# Altium project TPcape_basic.PrjPCB
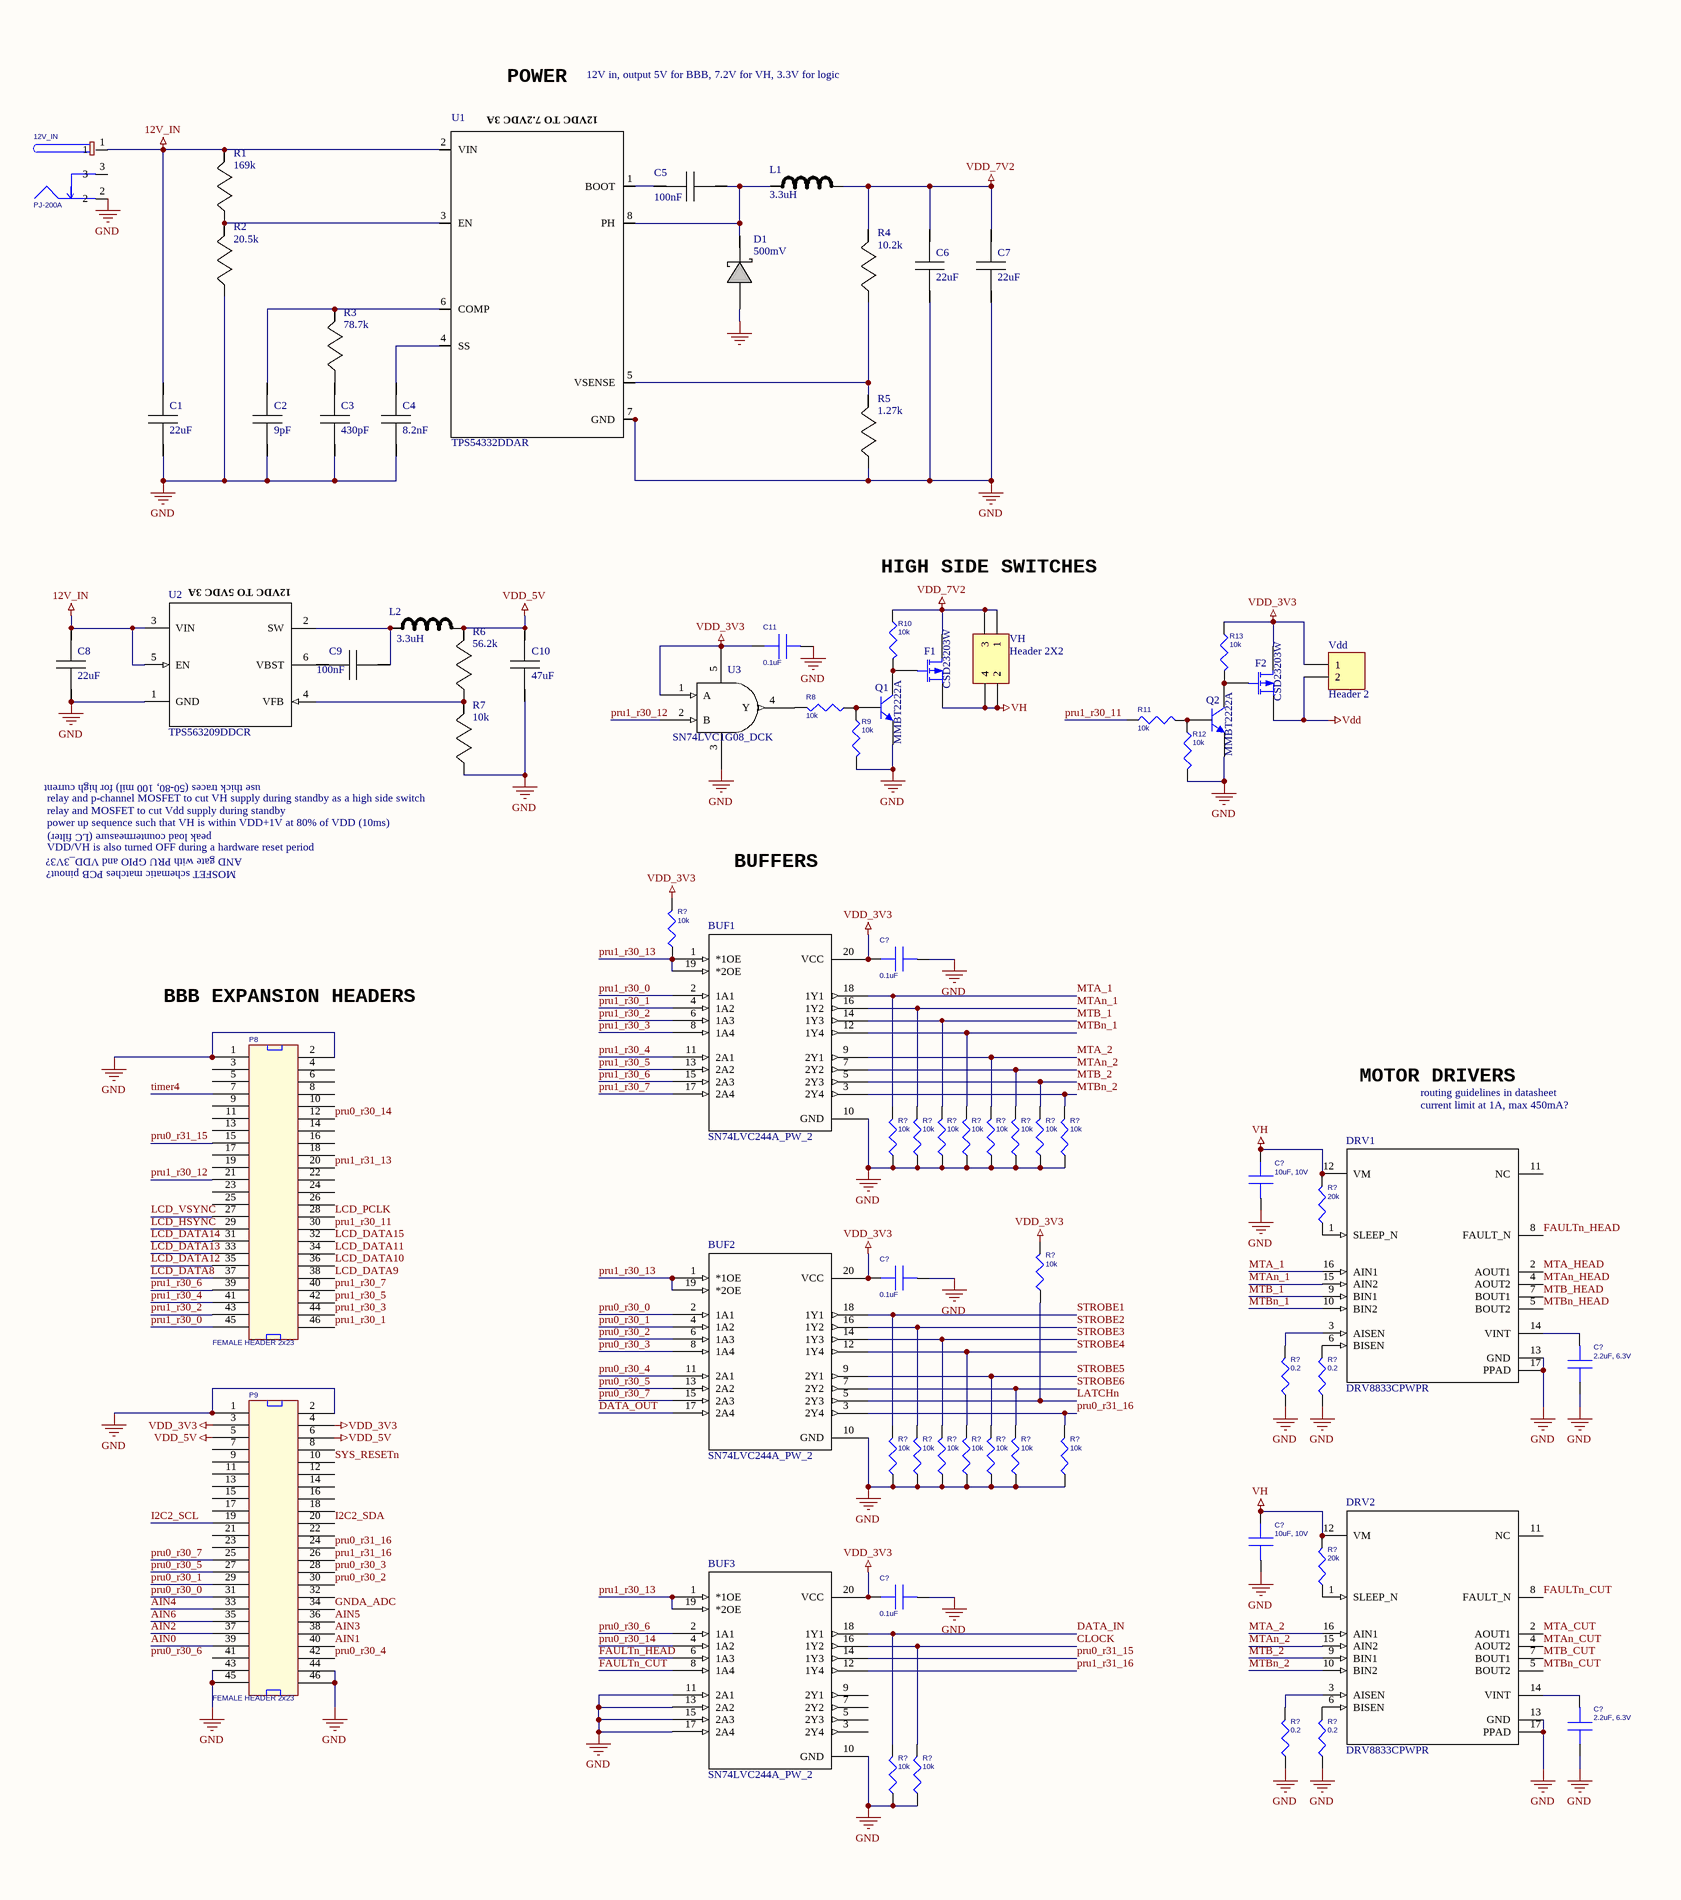
[diagram p0: TPcape_basic.SchDoc, left]
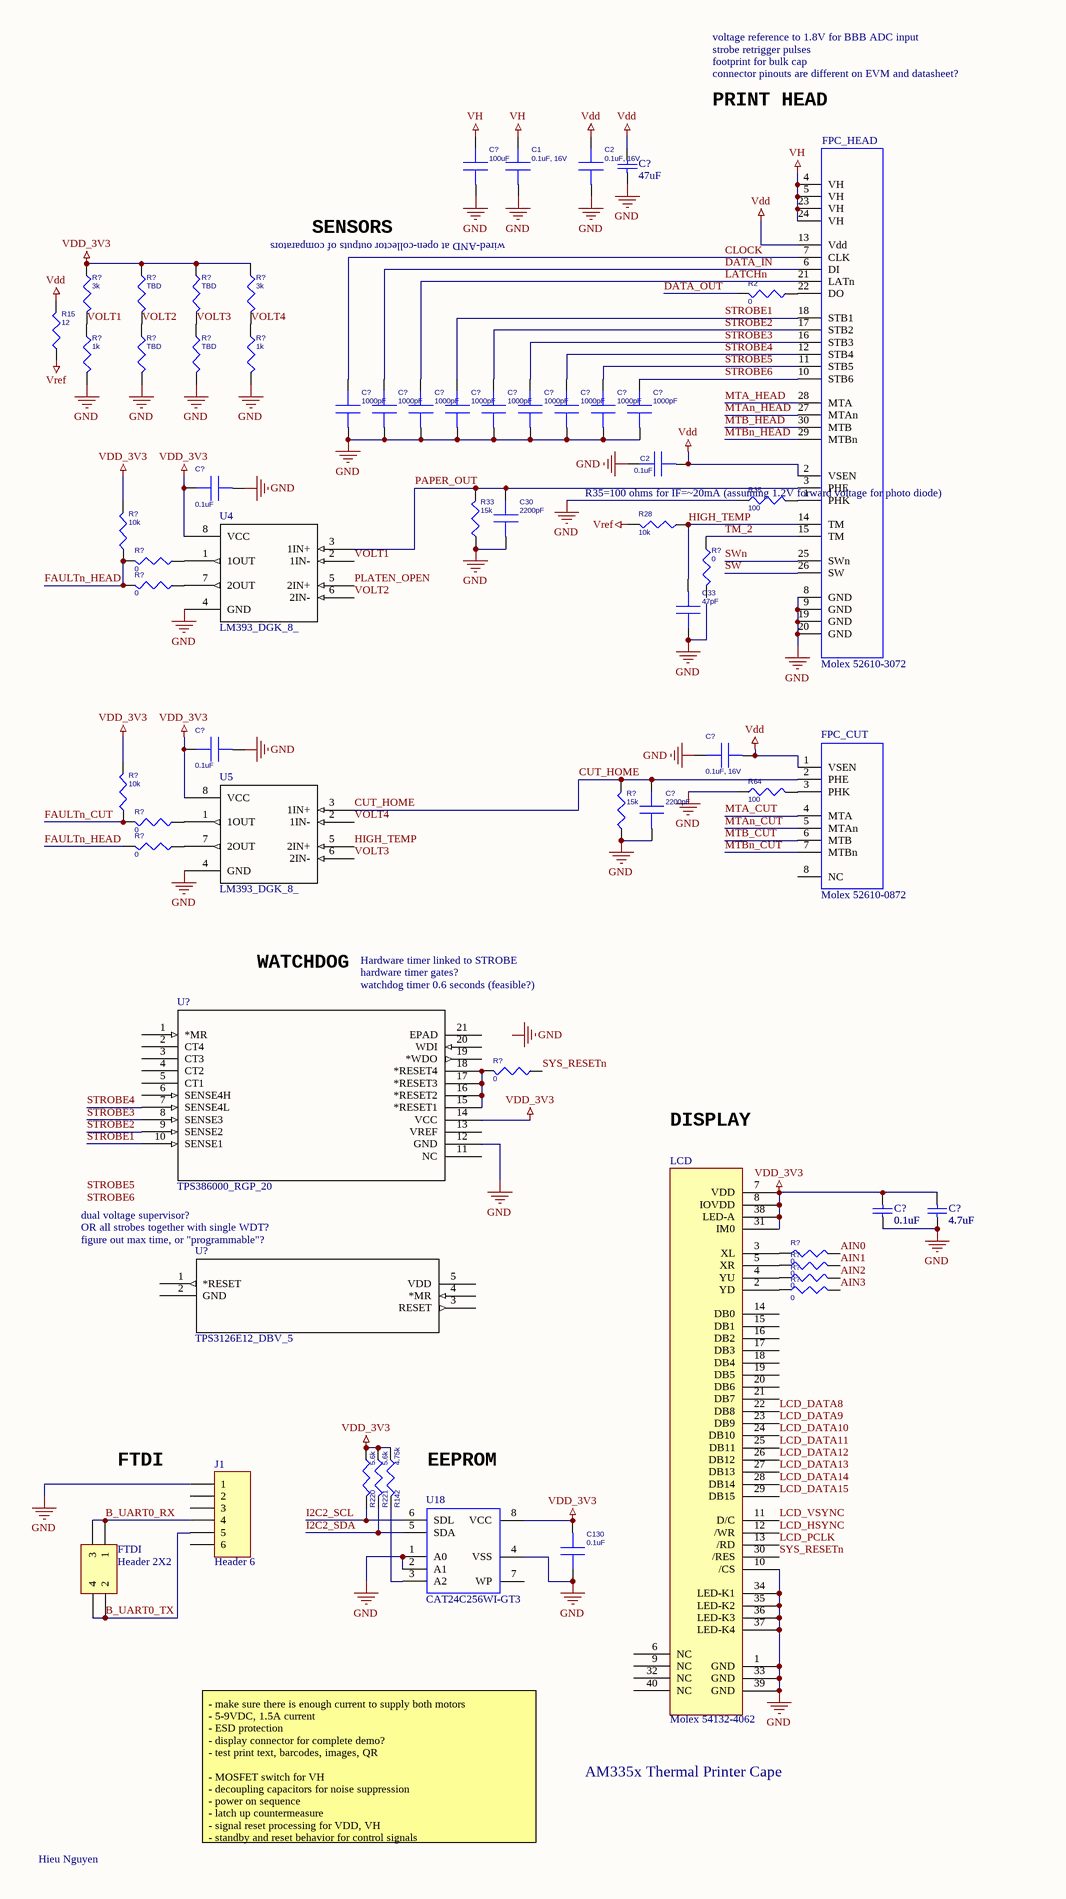
[diagram p1: TPcape_basic.SchDoc, right]
1 sheet, 139 parts. Net scope: global (net labels, ports and power ports of the same name join across sheets).
Board file: TPcape_basic.PcbDoc

## Sheet TPcape_basic.SchDoc
size A2; PageSetup: Record=PageOptions|CenterHorizontal=True|CenterVertical=True|PrintScale=0.77|XCorrection=1.00|YCorrection=1.00|PrintKind=1|BorderSize=5000000|LeftOffset=0|BottomOffset=0|Orientation=2|PaperLength=1000|PaperWidth=1000|Scale=100|PaperSource=7|PrintQuality=-4|MediaType=1|DitherType=10|PrintScaleMode=1|PaperKind=A5|PaperIndex=11

### Parts
(Parts that share a designator on the sheet are numbered #1, #2 ... from top to bottom, then left to right.)
12V_IN  PJ-200A  [CONN3-PWR-PJ102A]
BUF1  SN74LVC244A_PW_2  [PW20]
BUF2  SN74LVC244A_PW_2  [PW20]
BUF3  SN74LVC244A_PW_2  [PW20]
C1#1  0.1uF, 16V  [402]
C1#2  22uF  [1210]
C2#1  0.1uF, 16V  [402]
C2#2  9pF  [0805]
C2#3  0.1uF  [402]
C3  430pF  [0805]
C4  8.2nF  [0201]
C5  100nF  [1005]
C6  22uF  [1210]
C7  22uF  [1210]
C8  22uF  [1210]
C9  100nF  [0805]
C10  47uF  [1206]
C11  0.1uF  [402]
C30  2200pF  [402]
C33  47pF  [402]
C130  0.1uF  [402]
C?#1  47uF  [C1206]
C?#2  100uF  [RD205SMD_250D]
C?#3  1000pF  [402]
C?#4  1000pF  [402]
C?#5  1000pF  [402]
C?#6  1000pF  [402]
C?#7  1000pF  [402]
C?#8  1000pF  [402]
C?#9  1000pF  [402]
C?#10  1000pF  [402]
C?#11  1000pF  [402]
C?#12  0.1uF  [402]
C?#13  0.1uF  [402]
C?#14  0.1uF, 16V  [402]
C?#15  2200pF  [402]
C?#16  0.1uF  [402]
C?#17  10uF, 10V  [805]
C?#18  0.1uF  [0402]
C?#19  4.7uF  [C1206]
C?#20  0.1uF  [402]
C?#21  2.2uF, 6.3V  [402]
C?#22  10uF, 10V  [805]
C?#23  0.1uF  [402]
C?#24  2.2uF, 6.3V  [402]
D1  500mV  [SMB]
DRV1  DRV8833CPWPR  [DRV8833CPWPR]
DRV2  DRV8833CPWPR  [DRV8833CPWPR]
F1  CSD23203W  [CSD23203W]
F2  CSD23203W  [CSD23203W]
FPC_CUT  Molex 52610-0872  [Molex 52610-0872]
FPC_HEAD  Molex 52610-3072  [Molex 52610-3072]
FTDI  Header 2X2  [SSM-102-S-DV]
J1  Header 6  [HDR1X6]
L1  3.3uH  [XAL4030]
L2  3.3uH  [VLP8040]
LCD  Molex 54132-4062  [Molex 54132-4062]
P8  FEMALE HEADER 2x23  [HDR2x23]
P9  FEMALE HEADER 2x23  [HDR2X23]
Q1  MMBT2222A  [MMBT2222A]
Q2  MMBT2222A  [MMBT2222A]
R1  169k  [0402]
R2#1  20.5k  [0402]
R2#2  0  [402]
R3  78.7k  [0402]
R4  10.2k  [0402]
R5  1.27k  [0402]
R6  56.2k  [0402]
R7  10k  [0402]
R8  10k  [402]
R9  10k  [402]
R10  10k  [402]
R11  10k  [402]
R12  10k  [402]
R13  10k  [402]
R15  12  [402]
R28  10k  [402]
R33  15k  [402]
R35  100  [805]
R64  100  [805]
R142  4.75k  [402]
R220  5.6k  [402]
R221  5.6k  [402]
R?#1  3k  [402]
R?#2  TBD  [402]
R?#3  TBD  [402]
R?#4  3k  [402]
R?#5  1k  [402]
R?#6  TBD  [402]
R?#7  TBD  [402]
R?#8  1k  [402]
R?#9  10k  [402]
R?#10  0  [402]
R?#11  0  [402]
R?#12  0  [402]
R?#13  10k  [402]
R?#14  0  [402]
R?#15  15k  [402]
R?#16  0  [402]
R?#17  10k  [402]
R?#18  0  [402]
R?#19  10k  [402]
R?#20  10k  [402]
R?#21  10k  [402]
R?#22  10k  [402]
R?#23  10k  [402]
R?#24  10k  [402]
R?#25  10k  [402]
R?#26  10k  [402]
R?#27  20k  [402]
R?#28  0  [402]
R?#29  10k  [402]
R?#30  0  [402]
R?#31  0  [402]
R?#32  0  [402]
R?#33  0.2  [402]
R?#34  0.2  [402]
R?#35  10k  [402]
R?#36  10k  [402]
R?#37  10k  [402]
R?#38  10k  [402]
R?#39  10k  [402]
R?#40  10k  [402]
R?#41  10k  [402]
R?#42  20k  [402]
R?#43  0.2  [402]
R?#44  0.2  [402]
R?#45  10k  [402]
R?#46  10k  [402]
U1  TPS54332DDAR  [DDA0008H]
U2  TPS563209DDCR  [DDC0006A]
U3  SN74LVC1G08_DCK  [DCK5]
U4  LM393_DGK_8_  [DGK8]
U5  LM393_DGK_8_  [DGK8]
U18  CAT24C256WI-GT3  [CAT24C256WI-GT3]
U?#1  TPS386000_RGP_20  [RGP20_2P15X2P15]
U?#2  TPS3126E12_DBV_5  [DBV5]
Vdd  Header 2  [HDR1X2]
VH  Header 2X2  [HDR2X2]

### Nets
0: D1.2(A)
12V_IN: 12V_IN.1 C1#2.1 C8.1 R1.1 U1.2(VIN) U2.3(VIN) U2.5(EN)
GND: 12V_IN.2 BUF1.10(GND) BUF2.10(GND) BUF3.10(GND) BUF3.11(2A1) BUF3.13(2A2) BUF3.15(2A3) BUF3.17(2A4) C1#1.1 C1#2.2 C2#1.1 C2#2.2 C2#3.2 C3.2 C4.2 C6.2 C7.2 C8.2 C10.2 C11.1 C30.1 C33.2 C130.2 C?#1.1 C?#2.1 C?#3.1 C?#4.1 C?#5.1 C?#6.1 C?#7.1 C?#8.1 C?#9.1 C?#10.1 C?#11.1 C?#12.1 C?#13.1 C?#14.2 C?#15.1 C?#16.1 C?#17.1 C?#18.1 C?#19.1 C?#20.1 C?#21.2 C?#22.1 C?#23.1 C?#24.2 DRV1.13(GND) DRV1.17(PPAD) DRV2.13(GND) DRV2.17(PPAD) FPC_HEAD.8(GND) FPC_HEAD.9(GND) FPC_HEAD.19(GND) FPC_HEAD.20(GND) J1.1 LCD.1(GND) LCD.10(/CS) LCD.33(GND) LCD.34(LED-K1) LCD.35(LED-K2) LCD.36(LED-K3) LCD.37(LED-K4) LCD.39(GND) P8.1 P8.2 P9.1 P9.2 P9.43 P9.44 P9.45 P9.46 Q1.1(B) Q2.1(B) R2#1.2 R5.2 R7.2 R9.1(P1) R12.1(P1) R33.2(P2) R35.2(P2) R64.2(P2) R?#5.1(P1) R?#6.1(P1) R?#7.1(P1) R?#8.1(P1) R?#15.2(P2) R?#19.2(P2) R?#20.2(P2) R?#21.2(P2) R?#22.2(P2) R?#23.2(P2) R?#24.2(P2) R?#25.2(P2) R?#26.2(P2) R?#33.2(P2) R?#34.2(P2) R?#35.2(P2) R?#36.2(P2) R?#37.2(P2) R?#38.2(P2) R?#39.2(P2) R?#40.2(P2) R?#41.2(P2) R?#43.2(P2) R?#44.2(P2) R?#45.2(P2) R?#46.2(P2) U1.7(GND) U1.9(GND) U2.1(GND) U3.3(GND) U4.4(GND) U5.4(GND) U18.1(A0) U18.2(A1) U18.4(VSS) U?#1.12(GND)
Vdd: C2#1.2 C2#3.1 C?#1.2 C?#14.1 F2.A2,_B1,_B2(S) FPC_CUT.1(VSEN) FPC_HEAD.2(VSEN) FPC_HEAD.13(Vdd) R15.1(P1) Vdd.2
VDD_3V3: BUF1.20(VCC) BUF2.20(VCC) BUF3.20(VCC) C11.2 C130.1 C?#12.2 C?#13.2 C?#16.2 C?#18.2 C?#19.2 C?#20.2 C?#23.2 F2.C1,_C2(D) LCD.7(VDD) LCD.8(IOVDD) LCD.31(IM0) LCD.38(LED-A) P9.3 P9.4 R13.2(P2) R142.2(P2) R220.2(P2) R221.2(P2) R?#1.2(P2) R?#2.2(P2) R?#3.2(P2) R?#4.2(P2) R?#9.1(P1) R?#13.1(P1) R?#17.1(P1) R?#29.1(P1) U3.1(A) U3.5(VCC) U4.8(VCC) U5.8(VCC) U18.8(VCC) U?#1.14(VCC) Vdd.1
VDD_5V: C10.1 L2.2 P9.5 P9.6 R6.1
VDD_7V2: C6.1 C7.1 F1.C1,_C2(D) L1.2 R4.1 R10.2(P2) VH.1 VH.3
VH: C1#1.2 C?#2.2 C?#17.2 C?#22.2 DRV1.12(VM) DRV2.12(VM) F1.A2,_B1,_B2(S) FPC_HEAD.4(VH) FPC_HEAD.5(VH) FPC_HEAD.23(VH) FPC_HEAD.24(VH) R?#27.1(P1) R?#42.1(P1) VH.2 VH.4
Vref: R15.2(P2) R28.1(P1)
AIN0: P9.39 R?#28.1(P1)
AIN1: P9.40 R?#30.1(P1)
AIN2: P9.37 R?#31.1(P1)
AIN3: P9.38 R?#32.1(P1)
AIN4: P9.33
AIN5: P9.36
AIN6: P9.35
B_UART0_RX: FTDI.1 FTDI.3 J1.4
B_UART0_TX: FTDI.2 FTDI.4 J1.5
CLOCK: BUF3.16(1Y2) C?#3.2 FPC_HEAD.7(CLK) R?#46.1(P1)
CUT_HOME: C?#15.2 FPC_CUT.2(PHE) R?#15.1(P1) U5.3(1IN+)
DATA_IN: BUF3.18(1Y1) C?#4.2 FPC_HEAD.6(DI) R?#45.1(P1)
DATA_OUT: BUF2.17(2A4) R2#2.1(P1)
FAULTn_CUT: BUF3.8(1A4) DRV2.8(FAULT_N) R?#13.2(P2) R?#14.1(P1)
FAULTn_HEAD: BUF3.6(1A3) DRV1.8(FAULT_N) R?#9.2(P2) R?#10.1(P1) R?#12.1(P1) R?#16.1(P1)
GNDA_ADC: P9.34
HIGH_TEMP: C33.1 FPC_HEAD.14(TM) R28.2(P2) U5.5(2IN+)
I2C2_SCL: P9.19 R220.1(P1) U18.6(SDL)
I2C2_SDA: P9.20 R221.1(P1) U18.5(SDA)
LATCHn: BUF2.5(2Y3) C?#5.2 FPC_HEAD.21(LATn) R?#29.2(P2)
LCD_DATA8: LCD.22(DB8) P8.37
LCD_DATA9: LCD.23(DB9) P8.38
LCD_DATA10: LCD.24(DB10) P8.36
LCD_DATA11: LCD.25(DB11) P8.34
LCD_DATA12: LCD.26(DB12) P8.35
LCD_DATA13: LCD.27(DB13) P8.33
LCD_DATA14: LCD.28(DB14) P8.31
LCD_DATA15: LCD.29(DB15) P8.32
LCD_HSYNC: LCD.12(/WR) P8.29
LCD_PCLK: LCD.13(/RD) P8.28
LCD_VSYNC: LCD.11(D/C) P8.27
MTA_1: BUF1.18(1Y1) DRV1.16(AIN1) R?#19.1(P1)
MTA_2: BUF1.9(2Y1) DRV2.16(AIN1) R?#23.1(P1)
MTA_CUT: DRV2.2(AOUT1) FPC_CUT.4(MTA)
MTA_HEAD: DRV1.2(AOUT1) FPC_HEAD.28(MTA)
MTAn_1: BUF1.16(1Y2) DRV1.15(AIN2) R?#20.1(P1)
MTAn_2: BUF1.7(2Y2) DRV2.15(AIN2) R?#24.1(P1)
MTAn_CUT: DRV2.4(AOUT2) FPC_CUT.5(MTAn)
MTAn_HEAD: DRV1.4(AOUT2) FPC_HEAD.27(MTAn)
MTB_1: BUF1.14(1Y3) DRV1.9(BIN1) R?#21.1(P1)
MTB_2: BUF1.5(2Y3) DRV2.9(BIN1) R?#25.1(P1)
MTB_CUT: DRV2.7(BOUT1) FPC_CUT.6(MTB)
MTB_HEAD: DRV1.7(BOUT1) FPC_HEAD.30(MTB)
MTBn_1: BUF1.12(1Y4) DRV1.10(BIN2) R?#22.1(P1)
MTBn_2: BUF1.3(2Y4) DRV2.10(BIN2) R?#26.1(P1)
MTBn_CUT: DRV2.5(BOUT2) FPC_CUT.7(MTBn)
MTBn_HEAD: DRV1.5(BOUT2) FPC_HEAD.29(MTBn)
PAPER_OUT: C30.2 FPC_HEAD.3(PHE) R33.1(P1) U4.3(1IN+)
PLATEN_OPEN: U4.5(2IN+)
pru0_r30_0: BUF2.2(1A1) P9.31
pru0_r30_1: BUF2.4(1A2) P9.29
pru0_r30_2: BUF2.6(1A3) P9.30
pru0_r30_3: BUF2.8(1A4) P9.28
pru0_r30_4: BUF2.11(2A1) P9.42
pru0_r30_5: BUF2.13(2A2) P9.27
pru0_r30_6: BUF3.2(1A1)
pru0_r30_7: BUF2.15(2A3) P9.25
pru0_r30_14: BUF3.4(1A2) P8.12
pru0_r31_15: BUF3.14(1Y3) P8.15
pru0_r31_16: BUF2.3(2Y4) P9.24 R?#41.1(P1)
pru1_r30_0: BUF1.2(1A1) P8.45
pru1_r30_1: BUF1.4(1A2) P8.46
pru1_r30_2: BUF1.6(1A3) P8.43
pru1_r30_3: BUF1.8(1A4) P8.44
pru1_r30_4: BUF1.11(2A1) P8.41
pru1_r30_5: BUF1.13(2A2) P8.42
pru1_r30_6: BUF1.15(2A3) P8.39
pru1_r30_7: BUF1.17(2A4) P8.40
pru1_r30_11: P8.30 R11.2(P2)
pru1_r30_12: P8.21 U3.2(B)
pru1_r30_13: BUF1.1(*1OE) BUF1.19(*2OE) BUF2.1(*1OE) BUF2.19(*2OE) BUF3.1(*1OE) BUF3.19(*2OE) R?#17.2(P2)
pru1_r31_13: P8.20
pru1_r31_16: BUF3.12(1Y4) P9.26
STROBE1: BUF2.18(1Y1) C?#6.2 FPC_HEAD.18(STB1) R?#35.1(P1) U?#1.10(SENSE1)
STROBE2: BUF2.16(1Y2) C?#7.2 FPC_HEAD.17(STB2) R?#36.1(P1) U?#1.9(SENSE2)
STROBE3: BUF2.14(1Y3) C?#8.2 FPC_HEAD.16(STB3) R?#37.1(P1) U?#1.8(SENSE3)
STROBE4: BUF2.12(1Y4) C?#9.2 FPC_HEAD.12(STB4) R?#38.1(P1) U?#1.7(SENSE4L)
STROBE5: BUF2.9(2Y1) C?#10.2 FPC_HEAD.11(STB5) R?#39.1(P1)
STROBE6: BUF2.7(2Y2) C?#11.2 FPC_HEAD.10(STB6) R?#40.1(P1)
SW: FPC_HEAD.26(SW)
SWn: FPC_HEAD.25(SWn)
SYS_RESETn: LCD.30(/RES) P9.10 R?#18.2(P2)
timer4: P8.7
TM_2: FPC_HEAD.15(TM) R?#11.2(P2)
VOLT1: R?#1.1(P1) R?#5.2(P2) U4.2(1IN-)
VOLT2: R?#2.1(P1) R?#6.2(P2) U4.6(2IN-)
VOLT3: R?#3.1(P1) R?#7.2(P2) U5.6(2IN-)
VOLT4: R?#4.1(P1) R?#8.2(P2) U5.2(1IN-)
NetC2#2_1: C2#2.1 R3.1 U1.6(COMP)
NetC3_1: C3.1 R3.2
NetC4_1: C4.1 U1.4(SS)
NetC5_1: C5.1 D1.1(K) L1.1 U1.8(PH)
NetC5_2: C5.2 U1.1(BOOT)
NetC9_1: C9.1 L2.1 U2.2(SW)
NetC9_2: C9.2 U2.6(VBST)
NetC?#21_1: C?#21.1 DRV1.14(VINT)
NetC?#24_1: C?#24.1 DRV2.14(VINT)
NetDRV1_1: DRV1.1(SLEEP_N) R?#27.2(P2)
NetDRV1_3: DRV1.3(AISEN) R?#33.1(P1)
NetDRV1_6: DRV1.6(BISEN) R?#34.1(P1)
NetDRV2_1: DRV2.1(SLEEP_N) R?#42.2(P2)
NetDRV2_3: DRV2.3(AISEN) R?#43.1(P1)
NetDRV2_6: DRV2.6(BISEN) R?#44.1(P1)
NetF1_A1: F1.A1(G) Q1.3(C) R10.1(P1)
NetF2_A1: F2.A1(G) Q2.3(C) R13.1(P1)
NetFPC_CUT_3: FPC_CUT.3(PHK) R64.1(P1)
NetFPC_HEAD_1: FPC_HEAD.1(PHK) R35.1(P1)
NetFPC_HEAD_22: FPC_HEAD.22(DO) R2#2.2(P2)
NetLCD_2: LCD.2(YD) R?#32.2(P2)
NetLCD_3: LCD.3(XL) R?#28.2(P2)
NetLCD_4: LCD.4(YU) R?#31.2(P2)
NetLCD_5: LCD.5(XR) R?#30.2(P2)
NetQ1_2: Q1.2(E) R8.2(P2) R9.2(P2)
NetQ2_2: Q2.2(E) R11.1(P1) R12.2(P2)
NetR1_2: R1.2 R2#1.1 U1.3(EN)
NetR4_2: R4.2 R5.1 U1.5(VSENSE)
NetR6_2: R6.2 R7.1 U2.4(VFB)
NetR8_1: R8.1(P1) U3.4(Y)
NetR142_1: R142.1(P1) U18.3(A2)
NetR?#10_2: R?#10.2(P2) U4.1(1OUT)
NetR?#12_2: R?#12.2(P2) U4.7(2OUT)
NetR?#14_2: R?#14.2(P2) U5.1(1OUT)
NetR?#16_2: R?#16.2(P2) U5.7(2OUT)
NetR?#18_1: R?#18.1(P1) U?#1.15(*RESET1) U?#1.16(*RESET2) U?#1.17(*RESET3) U?#1.18(*RESET4)

Not connected (* = marked no-connect by the designer): 12V_IN 3; BUF3 3(2Y4) 5(2Y3) 7(2Y2) 9(2Y1); DRV1 11(NC); DRV2 11(NC); FPC_CUT 8(NC); J1 2 3 6; LCD 6(NC) 9(NC) 14(DB0) 15(DB1) 16(DB2) 17(DB3) 18(DB4) 19(DB5) 20(DB6) 21(DB7) 32(NC) 40(NC); P8 3(2) 4(27) 5(3) 6(28) 8(29) 9(5) 10(30) 11(6) 13(7) 14(32) 16(33) 17(9) 18(34) 19(10) 22(36) 23(12) 24(37) 25(13) 26(38); P9 7(4) 8(29) 9(5) 11(6) 12(31) 13(7) 14(32) 15(8) 16(33) 17(9) 18(34) 21(11) 22(36) 23(12) 32(41) 41(21); R?#11 1(P1); U18 7(WP); U?#1 1(*MR) 2(CT4) 3(CT3) 4(CT2) 5(CT1) 6(SENSE4H) 11(NC) 13(VREF) 19(*WDO) 20(WDI) 21(EPAD); U?#2 1(*RESET) 2(GND) 3(RESET) 4(*MR) 5(VDD)

### Notes on the sheet
- POWER
- 12V in, output 5V for BBB, 7.2V for VH, 3.3V for logic
- voltage reference to 1.8V for BBB ADC input
- strobe retrigger pulses
- footprint for bulk cap
- connector pinouts are different on EVM and datasheet?
- (near U1) 12VDC TO 7.2VDC 3A
- PRINT HEAD
- SENSORS
- (near R?#4) wired-AND at open-collector outputs of comparators
- R35=100 ohms for IF=~20mA (assuming 1.2V forward voltage for photo diode)
- (near U2) 12VDC TO 5VDC 3A
- HIGH SIDE SWITCHES
- (near R7) relay and p-channel MOSFET to cut VH supply during standby as a high side switch
- relay and MOSFET to cut Vdd supply during standby
- power up sequence such that VH is within VDD+1V at 80% of VDD (10ms)
- peak load countermeasure (LC filter)
- use thick traces (50-80, 100 mil) for high current
- VDD/VH is also turned OFF during a hardware reset period
- MOSFET schematic matches PCB pinout?
- AND gate with PRU GPIO and VDD_3V3?
- BUFFERS
- BBB EXPANSION HEADERS
- WATCHDOG
- hardware timer gates?
- Hardware timer linked to STROBE
- (near U?#1) watchdog timer 0.6 seconds (feasible?)
- MOTOR DRIVERS
- routing guidelines in datasheet
- current limit at 1A, max 450mA?
- DISPLAY
- dual voltage supervisor?
- OR all strobes together with single WDT?
- (near U?#2) figure out max time, or "programmable"?
- FTDI
- EEPROM
- AM335x Thermal Printer Cape
- - make sure there is enough current to supply both motors
  - 5-9VDC, 1.5A current
  - ESD protection
  - display connector for complete demo?
  - test print text, barcodes, images, QR
  - MOSFET switch for VH
  - decoupling capacitors for noise suppression
  - power on sequence
  - latch up countermeasure
  - signal reset processing for VDD, VH
  - standby and reset behavior for control signals
  - peak load countermeasure
  - thermister processing
  - motor drive circuit
  - Cape EEPROM
  - velcro for LCD
  - backlight and touchscreen controller circuit
  - fortune cookie generator, sudoku puzzle, money print, jokes, cartoonify-ed selfie
  - sign name, draw picture
  - LCD is 60.26mm x 42.72mm x 3.6mm
  - smaller vias (minimum hole size)
  - thinner traces (minimum?)
  - bigger holes for 2x23 header
  - reposition LCD connector (backwards)
  - 0805 footprint for caps
  - cut edge short to reveal status leds on BBB
- Hieu Nguyen
- Labels drawn without touching a wire or pin: GND, pru0_r30_6, STROBE5, STROBE6

### Library data of the parts
12V_IN = Power_Jack: CONN PWR JACK 2.1X5.5MM HIGH CUR; Manufacturer: CUI Inc; Manufacturer Part Number: PJ-002AH; Gender: Male; Plug/Mating Plug Diameter: 2.1mm ID, 5.5mm OD; Number of Positions/Contacts: 2 Conductors, 3 Contacts; Internal Switch(s): Single Switch, Normally Closed; Shielding: Unshielded; Current Rating: 5A; Supplier 1: Digi-Key; Supplier Part Number 1: CP-002AH-ND; RoHS: RoHS Compliant; Category: Connectors, Interconnects; Stock 1: 81962; Pricing 1: 1=1.01, 10=0.704, 100=0.4724, 500=0.3819, 1000=0.3417, 2500=0.27135 (USD); Connector Type: Jack; Mounting Type: Through Hole, Right Angle; Termination: Solder Eyelet(s); Features: -; Color: Black; Contact Material: Copper Alloy; Contact Material - Plating: Nickel; Housing Color: Black; Housing Material: Thermoplastic; Operating Temperature: -25°C ~ 85°C; ComponentLink1URL: http://www.cui.com/Product/Resource/DigiKeyPDF/PJ-002AH.pdf; ComponentLink1Description: http://www.cui.com/Product/Resource/DigiKeyPDF/PJ-002AH.pdf
BUF1-BUF3 = SN74LVC244A_PW_2: Imported; Manufacturer: Texas Instruments; INDUSTRY_STD_PKG_TYPE: TSSOP; FAMILY_NAME: NON-INVERTING BUFFER/DRIVER; PIN_COUNT: 20; PACKAGE_DESIGNATOR: PW; Datasheet URL: http://www.ti.com/lit/gpn/SN74LVC244A; GENERIC_PART_NUMBER: SN74LVC244A; RefDes: RefDes; Type: DEV; Value: Value
C1#1 C2#1 C11 C130 C?#3-C?#14 C?#16 C?#20 C?#21 C?#23 C?#24 = CAP SMD: No Description
C1#2 = GRM32ER61E226KE1: Imported; Manufacturer_Part_Number: GRM32ER61E226KE15L; Vendor: MuRata; Manufacturer_Name: MuRata; RefDes: RefDes; TYPE: TYPE; Value: Value
C2#2 = CC0805DRNP09BN9R: Imported; Manufacturer_Part_Number: CC0805DRNP09BN9R0; Vendor: Yageo America; Manufacturer_Name: Yageo America; RefDes: RefDes; TYPE: TYPE; Value: Value
C2#3 = CAP SMD: 16V 0402 SMD Murata GRM155F11C104ZA01
C3 = CL21C431JBANNNC: Imported; Vendor: Samsung Electro-Mechanics; Manufacturer_Part_Number: CL21C431JBANNNC; Manufacturer_Name: Samsung Electro-Mechanics; RefDes: RefDes; TYPE: TYPE; Value: Value
C4 = GRM033R61A822KA0: Imported; Manufacturer_Part_Number: GRM033R61A822KA01D; Vendor: MuRata; Manufacturer_Name: MuRata; RefDes: RefDes; TYPE: TYPE; Value: Value
C5 = C1005X5R1A104K: Imported; Vendor: TDK; Manufacturer_Part_Number: C1005X5R1A104K; Manufacturer_Name: TDK; RefDes: RefDes; TYPE: TYPE; Value: Value
C6-C8 = GRM32ER61C226KE2: Imported; Manufacturer_Part_Number: GRM32ER61C226KE20L; Vendor: MuRata; Manufacturer_Name: MuRata; RefDes: RefDes; TYPE: TYPE; Value: Value
C9 = 08053C104KAT2A: Imported; Vendor: AVX; Manufacturer_Part_Number: 08053C104KAT2A; Manufacturer_Name: AVX; RefDes: RefDes; TYPE: TYPE; Value: Value
C10 = GRM31CR61A476KE1: Imported; Manufacturer_Part_Number: GRM31CR61A476KE15L; Vendor: MuRata; Manufacturer_Name: MuRata; RefDes: RefDes; TYPE: TYPE; Value: Value
C30 C?#15 = CAP SMD: 0402 50V Murata GRM155B11H222KA01
C33 = CAP SMD: 0402, 50Vdc, 0+/-60ppm/C attach an appropriate temperature compensation capacitor based on the confirmation of ESD
C?#1 C?#18 C?#19 = Cap Semi: Capacitor (Semiconductor SIM Model); Published: 8-Jun-2000; LatestRevisionDate: 29-May-2009; LatestRevisionNote: IPC-7351 Footprint Added.; PackageReference: C1206; Publisher: Altium Limited; PackageDescription: Chip Capacitor
  C?#1: Value: 47uF
  C?#18: Value: 0.1uF
  C?#19: Value: 4.7uF
C?#2 = CAP SMD: Bulk capacitor for motor drive
C?#17 C?#22 = CAP SMD: Low-ESR ceramic bypass capacitor
D1 = B220-13-F: Imported; Vendor: Diodes Inc.; Manufacturer_Part_Number: B220-13-F; Manufacturer_Name: Diodes Inc.; RefDes: RefDes; Type: Type; Value: Value
DRV1 DRV2 = DRV8833CPWPR: Imported; Manufacturer: Texas Instruments; CompType: IC; PIN_COUNT: 17; Application_BuildNumber: *; PartNumber: DRV8833CPWPR; Alternate PartNumber: DRV8833CPWP; PackageReference: PWP0016K; MountType: SMT; RoHS: Y; RefDes: RefDes; Type: DEV; Value: Value
F1 F2 = CSD23203W: 8 V P-Channel NexFET Power MOSFET
FPC_CUT = Molex 52610-0872: FPC connector for Fujitsu FTP-628MCL401 (Molex 52610-0871 is obsolete)
FPC_HEAD = Molex 52610-3072: FPC connector for Fujitsu FTP-628MCL401 print head (Molex 52610-3071 is obsolete)
FTDI VH = Header 2X2: Header, 2-Pin, Dual row; LatestRevisionDate: 17-Jul-2002; LatestRevisionNote: Re-released for DXP Platform.; Publisher: Altium Limited
J1 = Header 6: Header, 6-Pin; LatestRevisionDate: 17-Jul-2002; LatestRevisionNote: Re-released for DXP Platform.; Publisher: Altium Limited
L1 = XAL4030-332MEB: Imported; Vendor: Coilcraft; Manufacturer_Part_Number: XAL4030-332MEB; Manufacturer_Name: Coilcraft; RefDes: RefDes; TYPE: TYPE; Value: Value
L2 = VLP8040T-3R3N: Imported; Vendor: TDK; Manufacturer_Part_Number: VLP8040T-3R3N; PACKAGE_DESIGNATOR: VLP8040; Manufacturer: TDK; Manufacturer_Name: TDK; RefDes: RefDes; TYPE: TYPE; Value: Value
LCD = Molex 54132-4062: FPC connector for NHD-2.4" LCD (specifically NHD-2.4-240320SF-CTXL#-FTN1)
P8 P9 = HDR_46_F_2_0.1_0.1: CONN HEADER FMAL 46PS.1" DL GOLD; Manufacturer: Sullins Connector Solutions; Manufacturer Part Number: PPPC232LFBN-RC; Number of Positions: 46; Number of Positions Loaded: All; Pitch: 0.100" (2.54mm); Supplier 1: Digi-Key; Supplier Part Number 1: S7126-ND; RoHS: RoHS Compliant; Category: Connectors, Interconnects; Stock 1: 750; Pricing 1: 1=2.75, 10=2.325, 25=2.2196, 50=2.0084, 100=1.7969, 250=1.58552, 500=1.4798, 1000=1.3741, 2500=1.32125 (USD); Connector Type: Header; Contact Type: Female Socket; Number of Rows: 2; Row Spacing: 0.100" (2.54mm); Mounting Type: Through Hole; Termination: Solder; Fastening Type: -; Features: -; Contact Finish: Gold; Contact Finish Thickness: Flash; Color: Black; Packaging: Bulk; ComponentLink1URL: http://www.sullinscorp.com/drawings/78_P(N)PxCxxxLFBN-RC,_10492-G.pdf; ComponentLink1Description: http://www.sullinscorp.com/drawings/78_P(N)PxCxxxLFBN-RC,_10492-G.pdf
Q1 Q2 = MMBT2222A: 40V NPN SMALL SIGNAL TRANSISTOR IN SOT23
R1 R2#1 R3 = CRCW040278K7FKED: Imported; Vendor: Vishay-Dale; Manufacturer_Name: Vishay-Dale; RefDes: RefDes; TYPE: TYPE; Value: Value
  R3: Manufacturer_Part_Number: CRCW040278K7FKED
R2#2 R8-R13 R?#1-R?#10 R?#12-R?#14 R?#16-R?#46 = RES SMD: RES 10K OHM 1/16W 5% 0402 SMD; Manufacturer: Rohm Semiconductor; Manufacturer Part Number: MCR01MZPJ103; Power (Watts): 0.063W, 1/16W; Temperature Coefficient: ±200ppm/°C; Supplier 1: Digi-Key; Supplier Part Number 1: RHM10KJDKR-ND; RoHS: RoHS Compliant; Category: Resistors; Stock 1: 452072; Pricing 1: 1=0.1, 10=0.019, 25=0.014, 100=0.0078, 250=0.00596, 500=0.00476, 1000=0.0035, 5000=0.00251 (USD); Composition: Thick Film; Features: Automotive AEC-Q200 Qualified; Tolerance: ±5%; Package / Case: 0402 (1005 Metric); Supplier Device Package: 0402 (1005 Metric); Size / Dimension: 0.039" L x 0.020" W (1.00mm x 0.50mm); Height: 0.016" (0.40mm); Number of Terminations: 2; Packaging: Digi-Reel®; ComponentLink1URL: http://rohmfs.rohm.com/en/products/databook/datasheet/passive/resistor/chip_resistor/mcr_a.pdf; ComponentLink1Description: http://rohmfs.rohm.com/en/products/databook/datasheet/passive/resistor/chip_resistor/mcr_a.pdf
  R2#2 R8-R13 R?#1-R?#10 R?#12-R?#14 R?#16-R?#26 R?#29 R?#35-R?#41 R?#45 R?#46: Resistance (Ohms): 10k
  R?#27 R?#42: Resistance (Ohms): 20k
  R?#28 R?#30-R?#32: Resistance (Ohms): 0
  R?#33 R?#34 R?#43 R?#44: Resistance (Ohms): 0.2
R4 = CRCW040210K2FKED: Imported; Vendor: Vishay-Dale; Manufacturer_Part_Number: CRCW040210K2FKED; Manufacturer_Name: Vishay-Dale; RefDes: RefDes; TYPE: TYPE; Value: Value
R5 = CRCW04021K27FKED: Imported; Vendor: Vishay-Dale; Manufacturer_Part_Number: CRCW04021K27FKED; Manufacturer_Name: Vishay-Dale; RefDes: RefDes; TYPE: TYPE; Value: Value
R6 = CRCW040256K2FKED: Imported; Vendor: Vishay-Dale; Manufacturer_Part_Number: CRCW040256K2FKED; Manufacturer_Name: Vishay-Dale; RefDes: RefDes; TYPE: TYPE; Value: Value
R7 = CRCW040210K0FKED: Imported; Vendor: Vishay-Dale; Manufacturer_Part_Number: CRCW040210K0FKED; Manufacturer_Name: Vishay-Dale; RefDes: RefDes; TYPE: TYPE; Value: Value
R15 = RES SMD: 2% shunt resistor to generate reference voltage; Manufacturer: Rohm Semiconductor; Manufacturer Part Number: MCR01MZPJ103; Resistance (Ohms): 10k; Power (Watts): 0.063W, 1/16W; Temperature Coefficient: ±200ppm/°C; Tolerance: ±5%; Supplier 1: Digi-Key; Supplier Part Number 1: RHM10KJDKR-ND; RoHS: RoHS Compliant; Category: Resistors; Stock 1: 452072; Pricing 1: 1=0.1, 10=0.019, 25=0.014, 100=0.0078, 250=0.00596, 500=0.00476, 1000=0.0035, 5000=0.00251 (USD); Composition: Thick Film; Features: Automotive AEC-Q200 Qualified; Package / Case: 0402 (1005 Metric); Supplier Device Package: 0402 (1005 Metric); Size / Dimension: 0.039" L x 0.020" W (1.00mm x 0.50mm); Height: 0.016" (0.40mm); Number of Terminations: 2; Packaging: Digi-Reel®; ComponentLink1URL: http://rohmfs.rohm.com/en/products/databook/datasheet/passive/resistor/chip_resistor/mcr_a.pdf; ComponentLink1Description: http://rohmfs.rohm.com/en/products/databook/datasheet/passive/resistor/chip_resistor/mcr_a.pdf
R28 R?#11 = RES SMD: Surface Mount Thick Film Chip Resistor 0402 Case 10K Ohms 1% Tolerance 100 PPM; Manufacturer: Rohm Semiconductor; Manufacturer Part Number: MCR01MZPJ103; Power (Watts): 0.063W, 1/16W; Temperature Coefficient: ±200ppm/°C; Tolerance: ±5%; Supplier 1: Digi-Key; Supplier Part Number 1: RHM10KJDKR-ND; RoHS: RoHS Compliant; Category: Resistors; Stock 1: 452072; Pricing 1: 1=0.1, 10=0.019, 25=0.014, 100=0.0078, 250=0.00596, 500=0.00476, 1000=0.0035, 5000=0.00251 (USD); Resistance (Ohms): 10k; Composition: Thick Film; Features: Automotive AEC-Q200 Qualified; Package / Case: 0402 (1005 Metric); Supplier Device Package: 0402 (1005 Metric); Size / Dimension: 0.039" L x 0.020" W (1.00mm x 0.50mm); Height: 0.016" (0.40mm); Number of Terminations: 2; Packaging: Digi-Reel®; ComponentLink1URL: http://rohmfs.rohm.com/en/products/databook/datasheet/passive/resistor/chip_resistor/mcr_a.pdf; ComponentLink1Description: http://rohmfs.rohm.com/en/products/databook/datasheet/passive/resistor/chip_resistor/mcr_a.pdf
R33 R?#15 = RES SMD: Surface Mount Thick Film Chip Resistor 0402 Case 15K Ohms 1% Tolerance 100 PPM; Manufacturer: Rohm Semiconductor; Manufacturer Part Number: MCR01MZPJ103; Power (Watts): 0.063W, 1/16W; Temperature Coefficient: ±200ppm/°C; Tolerance: ±5%; Supplier 1: Digi-Key; Supplier Part Number 1: RHM10KJDKR-ND; RoHS: RoHS Compliant; Category: Resistors; Stock 1: 452072; Pricing 1: 1=0.1, 10=0.019, 25=0.014, 100=0.0078, 250=0.00596, 500=0.00476, 1000=0.0035, 5000=0.00251 (USD); Resistance (Ohms): 15k; Composition: Thick Film; Features: Automotive AEC-Q200 Qualified; Package / Case: 0402 (1005 Metric); Supplier Device Package: 0402 (1005 Metric); Size / Dimension: 0.039" L x 0.020" W (1.00mm x 0.50mm); Height: 0.016" (0.40mm); Number of Terminations: 2; Packaging: Digi-Reel®; ComponentLink1URL: http://rohmfs.rohm.com/en/products/databook/datasheet/passive/resistor/chip_resistor/mcr_a.pdf; ComponentLink1Description: http://rohmfs.rohm.com/en/products/databook/datasheet/passive/resistor/chip_resistor/mcr_a.pdf
R35 R64 = RES SMD: RES 180 OHM 1/8W 5% 0805 SMD; Manufacturer: Rohm Semiconductor; Manufacturer Part Number: MCR01MZPJ103; Resistance (Ohms): 180; Power (Watts): 0.125W, 1/8W; Temperature Coefficient: ±200ppm/°C; Supplier 1: Digi-Key; Supplier Part Number 1: RHM10KJDKR-ND; RoHS: RoHS Compliant; Category: Resistors; Stock 1: 452072; Pricing 1: 1=0.1, 10=0.019, 25=0.014, 100=0.0078, 250=0.00596, 500=0.00476, 1000=0.0035, 5000=0.00251 (USD); Composition: Thick Film; Features: Automotive AEC-Q200 Qualified; Tolerance: ±5%; Package / Case: 0402 (1005 Metric); Supplier Device Package: 0402 (1005 Metric); Size / Dimension: 0.039" L x 0.020" W (1.00mm x 0.50mm); Height: 0.016" (0.40mm); Number of Terminations: 2; Packaging: Digi-Reel®; ComponentLink1URL: http://rohmfs.rohm.com/en/products/databook/datasheet/passive/resistor/chip_resistor/mcr_a.pdf; ComponentLink1Description: http://rohmfs.rohm.com/en/products/databook/datasheet/passive/resistor/chip_resistor/mcr_a.pdf
R142 R220 R221 = RES SMD: RES 5.6K OHM 1/16W 5% 0402 SMD; Manufacturer: Rohm Semiconductor; Manufacturer Part Number: MCR01MZPJ103; Power (Watts): 0.063W, 1/16W; Temperature Coefficient: ±200ppm/°C; Supplier 1: Digi-Key; Supplier Part Number 1: RHM10KJDKR-ND; RoHS: RoHS Compliant; Category: Resistors; Stock 1: 452072; Pricing 1: 1=0.1, 10=0.019, 25=0.014, 100=0.0078, 250=0.00596, 500=0.00476, 1000=0.0035, 5000=0.00251 (USD); Composition: Thick Film; Features: Automotive AEC-Q200 Qualified; Tolerance: ±5%; Package / Case: 0402 (1005 Metric); Supplier Device Package: 0402 (1005 Metric); Size / Dimension: 0.039" L x 0.020" W (1.00mm x 0.50mm); Height: 0.016" (0.40mm); Number of Terminations: 2; Packaging: Digi-Reel®; ComponentLink1URL: http://rohmfs.rohm.com/en/products/databook/datasheet/passive/resistor/chip_resistor/mcr_a.pdf; ComponentLink1Description: http://rohmfs.rohm.com/en/products/databook/datasheet/passive/resistor/chip_resistor/mcr_a.pdf
  R142: Resistance (Ohms): 4.75k
  R220 R221: Resistance (Ohms): 5.6k
U1 = TPS54332DDAR: Imported; Frequency: 1000000.0; Imax: 3.5; Vendor: Texas Instruments; Datasheet URL: http://www.ti.com/product/tps54332; Package: DDA0008H; Mktg_Package: DDA0008H; NSID: TPS54332DDAR; Manufacturer_Part_Number: TPS54332DDAR; Manufacturer_Name: Texas Instruments; RefDes: RefDes; TYPE: TYPE; Value: Value
U2 = TPS563209DDCR: Imported; Alternate Manufacturer: None; Manufacturer: Texas Instruments; CurrentTime: Not shown in title block; DocumentNumber: 1; SymbolCreator: a0411947; CompType: IC; U/M: EA; Designator: U?; PIN_COUNT: 6; CurrentDate: Not shown in title block; Time: Not shown in title block; Date: Not shown in title block; DocumentFullPathAndName: Not shown in title block; DocumentName: Not shown in title block; ModifiedDate: Not shown in title block; ApprovedBy: Not shown in title block; CheckedBy: Not shown in title block; Author: Not shown in title block; CompanyName: Not shown in title block; Engineer: Not shown in title block; Organization: Not shown in title block; Address1: Not shown in title block; Address2: Not shown in title block; Address3: Not shown in title block; Address4: Not shown in title block; Revision: Use project parameter SCH_Rev; SheetNumber: 1; SheetTotal: 1; ImagePath: Not shown in title block; Rule: *; ProjectName: *; SymbolVersion: 2014-04-11; PartNumber: TPS563209DDC; PackageReference: DDC0006A; MountType: SMT; ComponentLink1Description: Datasheet Link; ComponentLink1URL: https://sps06.itg.ti.com/sites/KMS/crossdivteams/altium/docs/ComponentDatasheets/TPS56320xDDC_User's_Guide_v0p1_14_0203.pdf; RoHS: Y; Publisher: Texas Instruments; LatestRevisionDate: 2014-04-14; Manufacturer_Part_Number: TPS563209DDCR; Manufacturer_Name: Texas Instruments; Refdes: Refdes; Type: Type; Value: Value
U3 = SN74LVC1G08_DCK: Imported; Manufacturer: Texas Instruments; Manufacturer_Part_Number: sn74lvc1g08_dck_5; INDUSTRY_STD_PKG_TYPE: SC70; FAMILY_NAME: LL AND GATE; PIN_COUNT: 5; PACKAGE_DESIGNATOR: DCK; Datasheet URL: http://www.ti.com/lit/gpn/SN74LVC1G08; GENERIC_PART_NUMBER: SN74LVC1G08; Vendor: Texas Instruments; RefDes: RefDes; Type: DEV; Value: Value
U4 U5 = LM393_DGK_8_: Imported; Manufacturer: Texas Instruments; GENERIC_PART_NUMBER: LM393; INDUSTRY_STD_PKG_TYPE: MSOP; FAMILY_NAME: COMPARATOR; PIN_COUNT: 8; PACKAGE_DESIGNATOR: DGK; Datasheet URL: http://www.ti.com/lit/gpn/LM393; RefDes: RefDes; Type: DEV; Value: Value
U18 = CAT24C256WI-GT3: IC EEPROM 256KBIT 400KHZ 8SOIC
U?#1 = TPS386000_RGP_20: Imported; Vendor: Texas Instruments; PACKAGE_DESIGNATOR: RGP; PIN_COUNT: 20; FAMILY_NAME: SUPERVISOR AND RESET IC; INDUSTRY_STD_PKG_TYPE: QFN; Manufacturer_Part_Number: tps386000_rgp_20; GENERIC_PART_NUMBER: TPS386000; Datasheet URL: http://www.ti.com/lit/gpn/TPS386000; Manufacturer: Texas Instruments; RefDes: RefDes; Type: DEV; Value: Value
U?#2 = TPS3126E12_DBV_5: Imported; Vendor: Texas Instruments; PACKAGE_DESIGNATOR: DBV; PIN_COUNT: 5; FAMILY_NAME: SUPERVISOR AND RESET IC; INDUSTRY_STD_PKG_TYPE: SOT-23; Manufacturer_Part_Number: tps3126e12_dbv_5; GENERIC_PART_NUMBER: TPS3126E12; Datasheet URL: http://www.ti.com/lit/gpn/TPS3126E12; Manufacturer: Texas Instruments; RefDes: RefDes; Type: DEV; Value: Value
Vdd = Header 2: Header, 2-Pin; LatestRevisionDate: 17-Jul-2002; LatestRevisionNote: Re-released for DXP Platform.; Publisher: Altium Limited